# EAGLE design RGBoard (EAGLE 6.0)
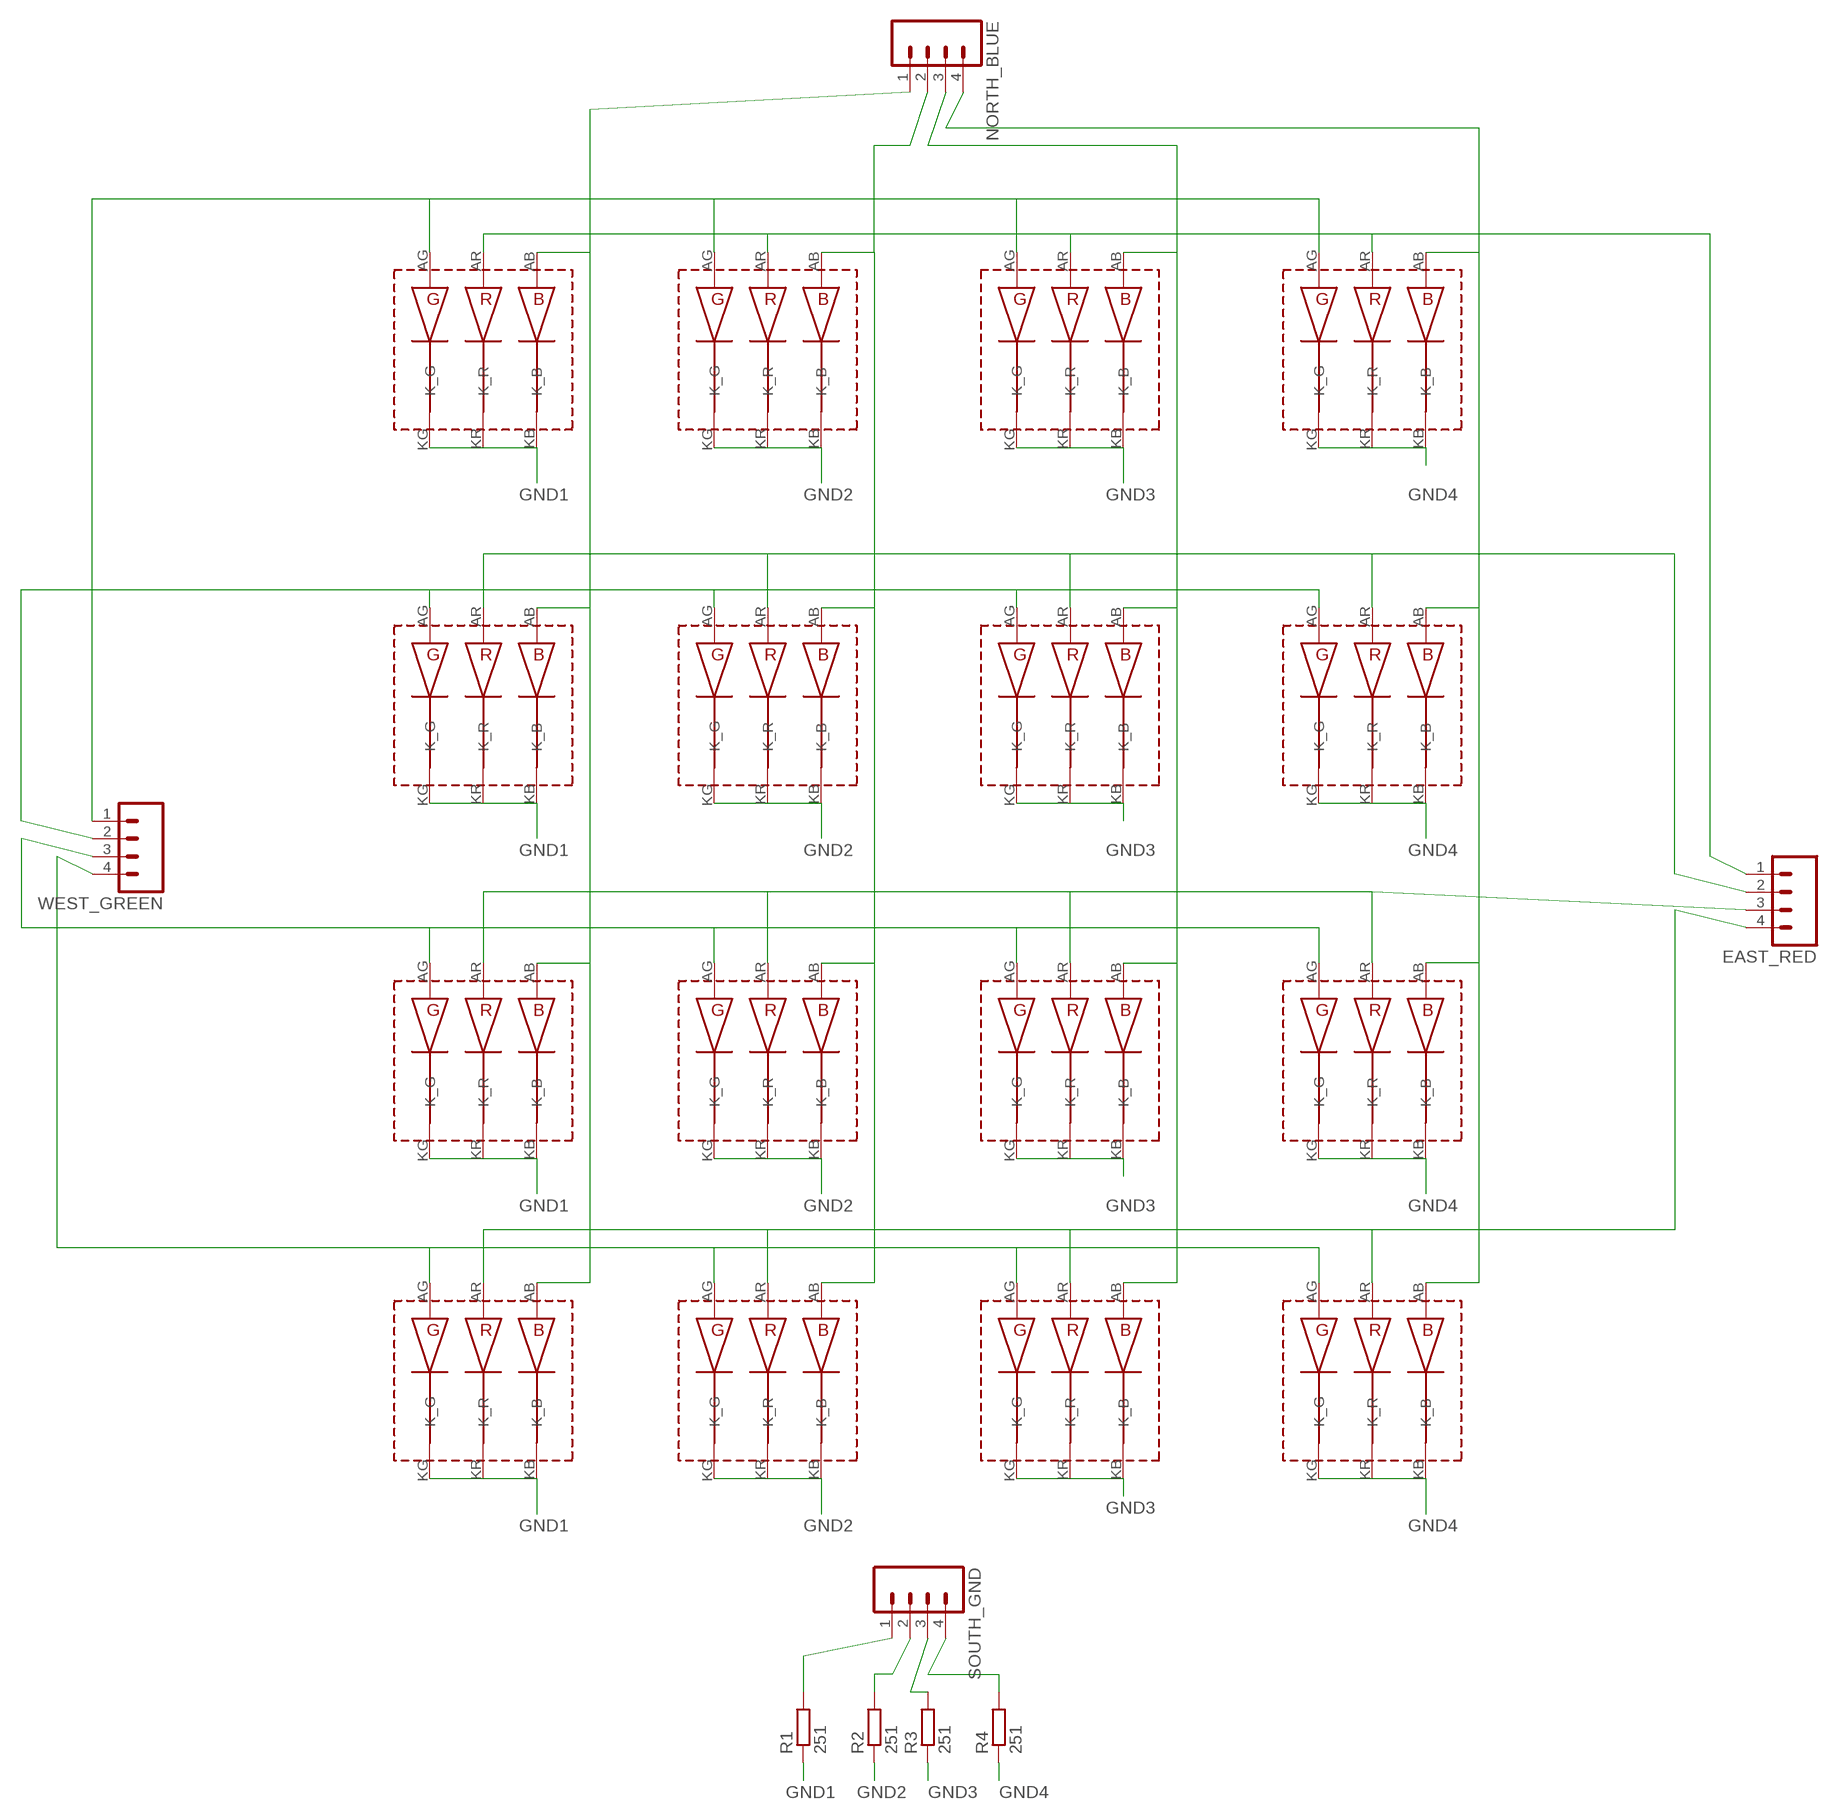
[diagram p0: schematic, sheet 1]

## Parts
A1  RGB-SMT-SQUARE  [SMT-SQUARE6]
A2  RGB-SMT-SQUARE  [SMT-SQUARE6]
A3  RGB-SMT-SQUARE  [SMT-SQUARE6]
A4  RGB-SMT-SQUARE  [SMT-SQUARE6]
B1  RGB-SMT-SQUARE  [SMT-SQUARE6]
B2  RGB-SMT-SQUARE  [SMT-SQUARE6]
B3  RGB-SMT-SQUARE  [SMT-SQUARE6]
B4  RGB-SMT-SQUARE  [SMT-SQUARE6]
C1  RGB-SMT-SQUARE  [SMT-SQUARE6]
C2  RGB-SMT-SQUARE  [SMT-SQUARE6]
C3  RGB-SMT-SQUARE  [SMT-SQUARE6]
C4  RGB-SMT-SQUARE  [SMT-SQUARE6]
D1  RGB-SMT-SQUARE  [SMT-SQUARE6]
D2  RGB-SMT-SQUARE  [SMT-SQUARE6]
D3  RGB-SMT-SQUARE  [SMT-SQUARE6]
D4  RGB-SMT-SQUARE  [SMT-SQUARE6]
EAST_RED  M04PTH  [1X04]
NORTH_BLUE  M04PTH  [1X04]
R1  251  R-EU_0204/7  [0204/7]
R2  251  R-EU_0204/7  [0204/7]
R3  251  R-EU_0204/7  [0204/7]
R4  251  R-EU_0204/7  [0204/7]
SOUTH_GND  M04PTH  [1X04]
WEST_GREEN  M04PTH  [1X04]

## Nets
GND1: A1.KB(K_B) A1.KG(K_G) A1.KR(K_R) B1.KB(K_B) B1.KG(K_G) B1.KR(K_R) C1.KB(K_B) C1.KG(K_G) C1.KR(K_R) D1.KB(K_B) D1.KG(K_G) D1.KR(K_R) R1.1
GND2: A2.KB(K_B) A2.KG(K_G) A2.KR(K_R) B2.KB(K_B) B2.KG(K_G) B2.KR(K_R) C2.KB(K_B) C2.KG(K_G) C2.KR(K_R) D2.KB(K_B) D2.KG(K_G) D2.KR(K_R) R2.1
GND3: A3.KB(K_B) A3.KG(K_G) A3.KR(K_R) B3.KB(K_B) B3.KG(K_G) B3.KR(K_R) C3.KB(K_B) C3.KG(K_G) C3.KR(K_R) D3.KB(K_B) D3.KG(K_G) D3.KR(K_R) R3.1
GND4: A4.KB(K_B) A4.KG(K_G) A4.KR(K_R) B4.KB(K_B) B4.KG(K_G) B4.KR(K_R) C4.KB(K_B) C4.KG(K_G) C4.KR(K_R) D4.KB(K_B) D4.KG(K_G) D4.KR(K_R) R4.1
N$1: R1.2 SOUTH_GND.1
N$2: R2.2 SOUTH_GND.2
N$3: R3.2 SOUTH_GND.3
N$4: R4.2 SOUTH_GND.4
N$5: A1.AR(ANODE_R) A2.AR(ANODE_R) A3.AR(ANODE_R) A4.AR(ANODE_R) EAST_RED.1
N$6: B1.AR(ANODE_R) B2.AR(ANODE_R) B3.AR(ANODE_R) B4.AR(ANODE_R) EAST_RED.2
N$7: C1.AR(ANODE_R) C2.AR(ANODE_R) C3.AR(ANODE_R) C4.AR(ANODE_R) EAST_RED.3
N$8: D1.AR(ANODE_R) D2.AR(ANODE_R) D3.AR(ANODE_R) D4.AR(ANODE_R) EAST_RED.4
N$9: A1.AB(ANODE_B) B1.AB(ANODE_B) C1.AB(ANODE_B) D1.AB(ANODE_B) NORTH_BLUE.1
N$10: A2.AB(ANODE_B) B2.AB(ANODE_B) C2.AB(ANODE_B) D2.AB(ANODE_B) NORTH_BLUE.2
N$11: A3.AB(ANODE_B) B3.AB(ANODE_B) C3.AB(ANODE_B) D3.AB(ANODE_B) NORTH_BLUE.3
N$12: A4.AB(ANODE_B) B4.AB(ANODE_B) C4.AB(ANODE_B) D4.AB(ANODE_B) NORTH_BLUE.4
N$13: A1.AG(ANODE_G) A2.AG(ANODE_G) A3.AG(ANODE_G) A4.AG(ANODE_G) WEST_GREEN.1
N$14: B1.AG(ANODE_G) B2.AG(ANODE_G) B3.AG(ANODE_G) B4.AG(ANODE_G) WEST_GREEN.2
N$15: C1.AG(ANODE_G) C2.AG(ANODE_G) C3.AG(ANODE_G) C4.AG(ANODE_G) WEST_GREEN.3
N$16: D1.AG(ANODE_G) D2.AG(ANODE_G) D3.AG(ANODE_G) D4.AG(ANODE_G) WEST_GREEN.4

## Library data of the parts
A1-A4 B1-B4 C1-C4 D1-D4 = kalshagar:RGB-SMT-SQUARE: A simple SMD RGB led square in about 6x6.6mm. Different models possible, be careful of the pinout (can be interverted so annotate your schema) Sold here http://akizukidenshi.com/catalog/g/gI-02225/
EAST_RED NORTH_BLUE SOUTH_GND WEST_GREEN = SparkFun:M04: Header 4 Standard 4-pin 0.1" header. Use with straight break away headers (SKU : PRT-00116), right angle break away headers (PRT-00553), swiss pins (PRT-00743), machine pins (PRT-00117), and female headers (PRT-00115). Molex polarized connector foot print use with SKU : PRT-08231 with associated crimp pins and housings. 1MM SMD Version SKU: PRT-10208
R1-R4 = resistor:R-EU_: RESISTOR, European symbol

## Board
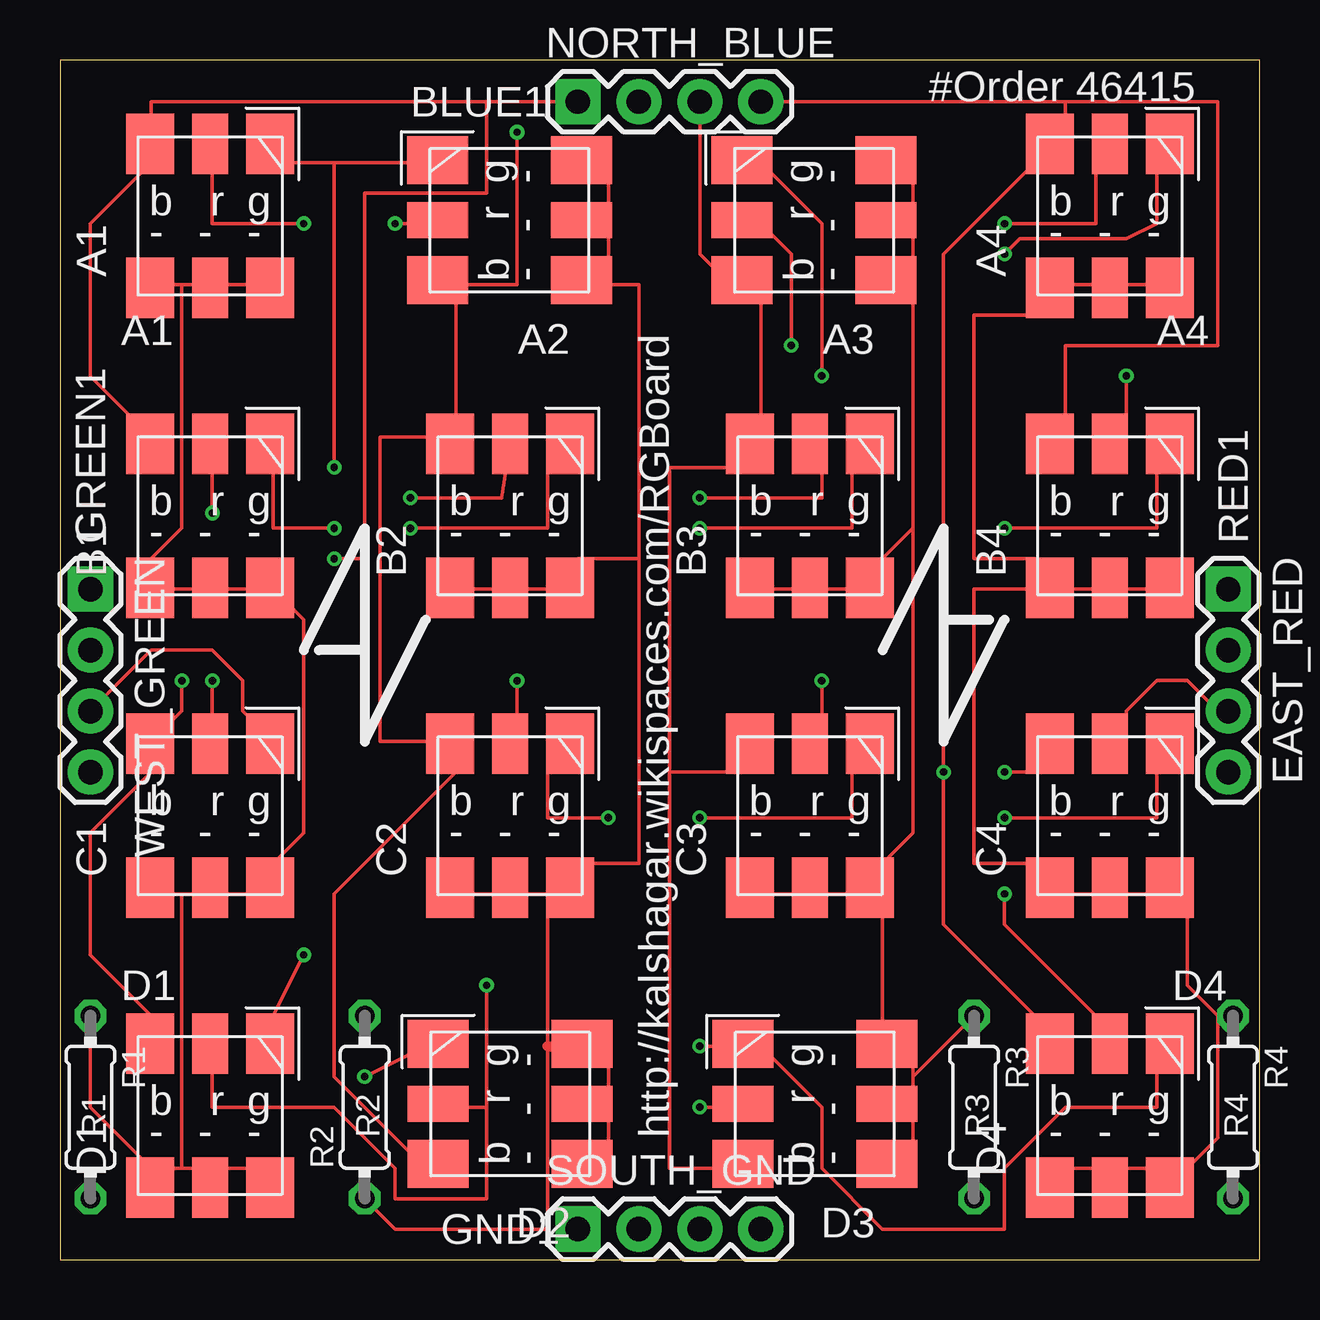
[diagram p1: board, top side]
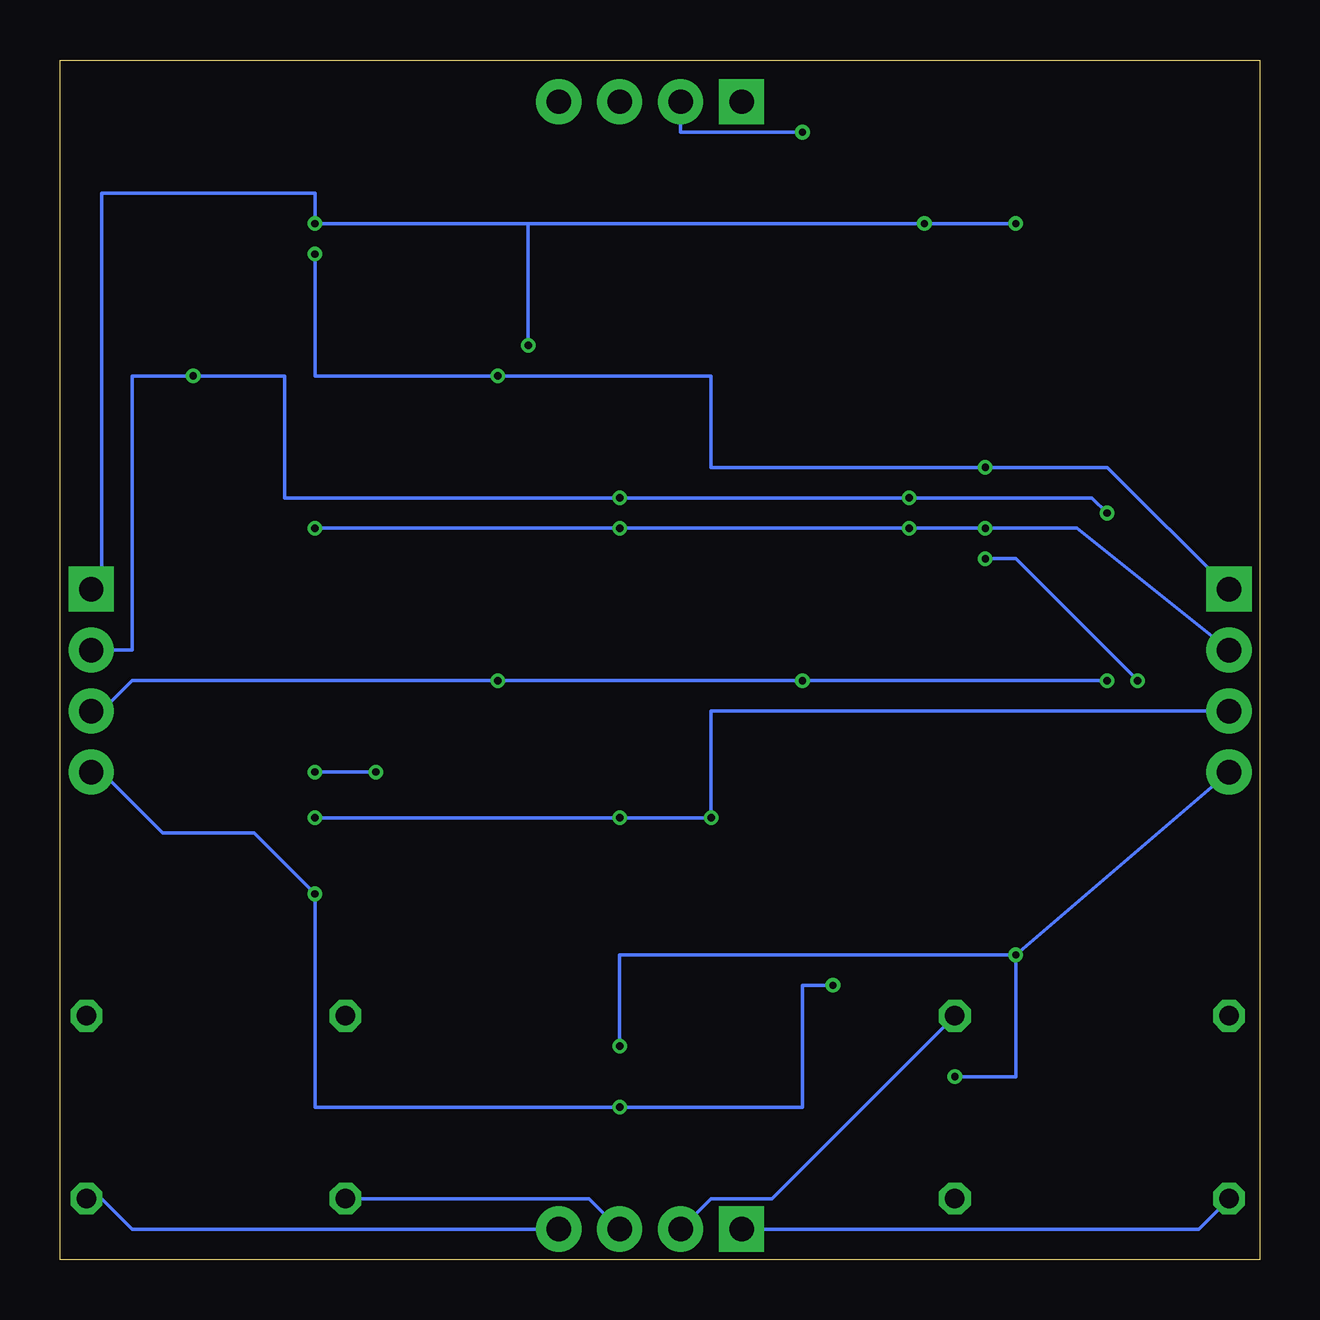
[diagram p2: board, bottom side, seen from below]

Size 50 x 50 mm. Coordinates in mm from the lower left corner, seen from the top.
Outline: 0,0 50,0 50,50 0,50 0,0
Copper layers (1*16): Top 0.035mm / dielectric 1.5mm / Bottom 0.035mm
Design rules: minimum track width 6mil, minimum drill 12mil, track to track 6mil, track to pad 6mil, pad to pad 6mil, via to via 6mil, smd to smd 0mil, copper to edge 10mil, drill to drill 10mil, minimum pad ring 10mil, minimum via ring 6mil, stop-mask expansion 2mil, vias tented up to drill 100mil, thermal gap 10mil

### Footprints (pad centres in the part's own frame; a part is rotated, then mirrored left to right if it is on the bottom)
SMT-SQUARE6 = smd 2 x 2.54: AB 0.5,3; AG 5.5,3; KB 0.5,-3; KG 5.5,-3 | smd 1.5 x 2.54: AR 3,3; KR 3,-3
1X04 = drill 1.016 pad 1.88 square: 1 0,0 | drill 1.016 pad 1.88: 2 2.54,0; 3 5.08,0; 4 7.62,0
0204/7 = drill 0.813 octagon: 1 -3.81,0; 2 3.81,0

### Placement (x,y rotation side)
A1  3.25,43.5 0 top
A2  18.73,40.31 90 top
A3  31.43,40.31 90 top
A4  40.75,43.5 0 top
B1  3.25,31 0 top
B2  15.75,31 0 top
B3  28.25,31 0 top
B4  40.75,31 0 top
C1  3.25,18.5 0 top
C2  15.75,18.5 0 top
C3  28.25,18.5 0 top
C4  40.75,18.5 0 top
D1  3.25,6 0 top
D2  18.77,3.48 90 top
D3  31.46,3.48 90 top
D4  40.75,6 0 top
EAST_RED  48.7,27.94 270 top
NORTH_BLUE  21.59,48.26 0 top
R1  1.27,6.35 270 top
R2  12.7,6.35 90 top
R3  38.1,6.35 270 top
R4  48.9,6.35 270 top
SOUTH_GND  21.59,1.27 0 top
WEST_GREEN  1.27,27.94 270 top

### Tracks (layer width: path | path; a pad name or v marks a point on that pad's centre or on a via)
GND1
  Top 0.152: 6.35,27.94 3.81,27.94 B1.KB 3.81,29.21 5.08,30.48 5.08,40.64 | 6.35,27.94 8.89,27.94 | 6.35,27.94 B1.KR | 6.35,40.64 5.08,40.64 | 5.08,40.64 3.81,40.64 A1.KB | 6.35,40.64 8.89,40.64 A1.KG | 6.35,40.64 A1.KR | 6.35,15.24 5.08,15.24 | 5.08,15.24 3.81,15.24 C1.KB | 6.35,15.24 8.89,15.24 C1.KG 8.89,16.51 10.16,17.78 10.16,26.67 8.89,27.94 | 6.35,15.24 C1.KR | 6.35,3.81 5.08,3.81 | 5.08,3.81 3.81,3.81 | 6.35,3.81 8.89,3.81 D1.KG | 6.35,3.81 D1.KR | R1.1 1.27,6.35 3.81,3.81 | 3.81,3.81 D1.KB | 5.08,3.81 5.08,15.24 | 8.89,27.94 B1.KG
GND2
  Top 0.152: 22.86,6.35 22.86,3.81 D2.KB | 22.86,6.35 22.86,8.89 D2.KG 21.59,8.89 | 22.86,6.35 D2.KR | 19.05,15.24 16.51,15.24 C2.KB | 19.05,15.24 20.32,15.24 | 19.05,15.24 C2.KR | R2.1 13.97,1.27 20.32,1.27 20.32,8.89 20.32,15.24 | 20.32,15.24 C2.KG 21.59,16.51 24.13,16.51 24.13,29.21 | 19.05,27.94 16.51,27.94 B2.KB | 19.05,27.94 20.32,27.94 B2.KG 21.59,29.21 24.13,29.21 | 19.05,27.94 B2.KR | 22.86,43.18 22.86,40.64 | 22.86,43.18 22.86,45.72 A2.KG | 22.86,43.18 A2.KR | 22.86,40.64 24.13,40.64 24.13,29.21 | 22.86,40.64 A2.KB
  Top 0.406: 20.32,8.89 21.59,8.89
GND3
  Top 0.152: 31.75,15.24 29.21,15.24 C3.KB | 31.75,15.24 33.02,15.24 C3.KG | 31.75,15.24 C3.KR | 35.56,6.35 35.56,3.81 D3.KB | 35.56,6.35 35.56,7.62 | 35.56,7.62 35.56,8.89 D3.KG 34.29,8.89 34.29,15.24 C3.KG | 35.56,6.35 D3.KR | 35.56,7.62 R3.1 | 31.75,27.94 29.21,27.94 B3.KB | 31.75,27.94 33.02,27.94 B3.KG 34.29,29.21 35.56,30.48 | 31.75,27.94 B3.KR | 35.56,43.18 35.56,40.64 | 35.56,43.18 35.56,45.72 A3.KG | 35.56,43.18 A3.KR | 35.56,40.64 35.56,30.48 | 35.56,40.64 A3.KB | 35.56,30.48 35.56,17.78 34.29,16.51 C3.KG
GND4
  Top 0.152: B4.KB 41.91,27.94 43.18,27.94 B4.KR 44.45,27.94 45.72,27.94 B4.KG | A4.KG 45.72,40.64 44.45,40.64 A4.KR 43.18,40.64 41.91,40.64 A4.KB 40.64,39.37 38.1,39.37 38.1,29.21 40.64,29.21 B4.KB | D4.KB 41.91,3.81 43.18,3.81 D4.KR 44.45,3.81 45.72,3.81 D4.KG 46.99,3.81 48.26,5.08 48.26,10.16 | 48.26,10.16 46.99,11.43 46.99,15.24 C4.KG 45.72,15.24 44.45,15.24 C4.KR 43.18,15.24 41.91,15.24 C4.KB 40.64,16.51 38.1,16.51 38.1,27.94 40.64,27.94 B4.KB | 48.26,10.16 R4.1
N$1
  Bottom 0.152: R1.2 2.54,1.27 SOUTH_GND.1
N$2
  Bottom 0.152: R2.2 20.32,2.54 22.86,2.54 SOUTH_GND.2
N$3
  Bottom 0.152: R3.2 27.94,2.54 SOUTH_GND.3
N$4
  Bottom 0.152: SOUTH_GND.4 46.99,1.27 48.26,2.54 R4.2
N$5  (via drill 0.3)
  Top 0.152: v13.97,43.18 15.24,43.18 A2.AR | v10.16,43.18 6.35,43.18 6.35,45.72 A1.AR | v30.48,38.1 30.48,41.91 29.21,43.18 A3.AR | v39.37,43.18 43.18,43.18 43.18,45.72 A4.AR
  Bottom 0.152: v10.16,43.18 v13.97,43.18 30.48,43.18 | v30.48,38.1 30.48,43.18 | 30.48,43.18 v39.37,43.18 39.37,44.45 48.26,44.45 48.26,27.94 EAST_RED.1
N$6  (via drill 0.3)
  Top 0.152: v6.35,31.11 6.35,33.02 B1.AR | v14.61,31.75 18.41,31.75 B2.AR | v26.67,31.75 31.75,31.75 31.75,33.02 B3.AR | v44.45,36.83 44.45,34.29 B4.AR
  Bottom 0.152: v6.35,31.11 6.99,31.75 v14.61,31.75 v26.67,31.75 40.64,31.75 40.64,36.83 v44.45,36.83 46.99,36.83 46.99,25.4 EAST_RED.2
N$7  (via drill 0.3)
  Top 0.152: v6.35,24.13 6.35,21.59 C1.AR | v19.05,24.13 19.05,21.59 C2.AR | v31.75,24.13 31.75,21.59 C3.AR | C4.AR 44.45,21.59 44.45,22.86 45.72,24.13 46.99,24.13 48.26,22.86 EAST_RED.3
  Bottom 0.152: v6.35,24.13 v19.05,24.13 v31.75,24.13 46.99,24.13 48.26,22.86 EAST_RED.3
N$8  (via drill 0.3)
  Top 0.152: 17.78,6.35 16.51,6.35 D2.AR | 17.78,6.35 17.78,2.54 13.97,2.54 13.97,3.81 11.43,6.35 6.35,6.35 6.35,8.89 D1.AR | v26.67,6.35 29.21,6.35 D3.AR | v39.37,15.24 39.37,13.97 43.18,10.16 D4.AR | v17.78,11.43 17.78,6.35
  Bottom 0.152: EAST_RED.4 48.26,20.32 45.72,17.78 41.91,17.78 v39.37,15.24 39.37,6.35 v26.67,6.35 19.05,6.35 19.05,11.43 v17.78,11.43
N$9  (via drill 0.3)
  Top 0.152: D1.AB 3.81,10.16 1.27,12.7 1.27,17.78 3.81,20.32 C1.AB 3.81,21.59 5.08,22.86 v5.08,24.13 | B1.AB 3.81,34.29 1.27,36.83 1.27,43.18 3.81,45.72 A1.AB 3.81,46.99 3.81,48.26 17.78,48.26 | 17.78,48.26 NORTH_BLUE.1 | v11.43,29.21 12.7,29.21 12.7,44.45 17.78,44.45 17.78,48.26
  Bottom 0.152: v5.08,24.13 10.16,29.21 v11.43,29.21
N$10  (via drill 0.3)
  Top 0.152: D2.AB 15.24,3.81 11.43,7.62 11.43,15.24 16.51,20.32 C2.AB 16.51,21.59 13.34,21.59 13.34,34.29 15.24,34.29 B2.AB 16.51,34.29 16.51,40.64 | v19.05,46.99 19.05,40.64 16.51,40.64 | 16.51,40.64 A2.AB
  Bottom 0.152: NORTH_BLUE.2 24.13,46.99 v19.05,46.99
N$11
  Top 0.152: NORTH_BLUE.3 26.67,41.91 27.94,40.64 A3.AB 29.21,40.64 29.21,34.29 B3.AB 27.94,33.02 25.4,33.02 25.4,20.32 | 25.4,20.32 25.4,3.81 27.94,3.81 D3.AB | 25.4,20.32 27.94,20.32 C3.AB
N$12  (via drill 0.3)
  Top 0.152: D4.AB 40.64,10.16 36.83,13.97 v36.83,20.32 36.83,41.91 40.64,45.72 A4.AB 41.91,46.99 41.91,48.26 | v39.37,20.32 40.64,20.32 C4.AB | 41.91,48.26 48.26,48.26 48.26,38.1 41.91,38.1 41.91,34.29 B4.AB | 41.91,48.26 NORTH_BLUE.4
  Bottom 0.152: v36.83,20.32 v39.37,20.32
N$13  (via drill 0.3)
  Top 0.152: 11.43,45.72 8.89,45.72 A1.AG | 11.43,45.72 15.24,45.72 A2.AG | v31.75,36.83 31.75,43.18 29.21,45.72 A3.AG | v39.37,41.91 40.01,42.55 44.45,42.55 45.72,43.18 45.72,45.72 A4.AG | v11.43,33.02 11.43,45.72
  Bottom 0.152: WEST_GREEN.1 6.35,33.02 v11.43,33.02 22.86,33.02 22.86,36.83 v31.75,36.83 39.37,36.83 v39.37,41.91
N$14  (via drill 0.3)
  Top 0.152: v11.43,30.48 8.89,30.48 8.89,33.02 B1.AG | v14.61,30.48 20.32,30.48 20.32,33.02 B2.AG | v26.67,30.48 33.02,30.48 33.02,33.02 B3.AG | v39.37,30.48 45.72,30.48 45.72,33.02 B4.AG
  Bottom 0.152: WEST_GREEN.2 7.62,30.48 v11.43,30.48 v14.61,30.48 v26.67,30.48 v39.37,30.48
N$15  (via drill 0.3)
  Top 0.152: WEST_GREEN.3 3.81,25.4 6.35,25.4 7.62,24.13 7.62,22.86 8.89,21.59 C1.AG | v22.86,18.41 20.32,18.41 20.32,20.32 C2.AG | v26.67,18.41 33.02,18.41 33.02,20.32 C3.AG | v39.37,18.41 45.72,18.41 45.72,20.32 C4.AG
  Bottom 0.152: WEST_GREEN.3 22.86,22.86 v22.86,18.41 v26.67,18.41 v39.37,18.41
N$16  (via drill 0.3)
  Top 0.152: D4.AG 45.72,8.89 45.72,6.35 41.91,6.35 39.37,3.81 39.37,1.27 34.29,1.27 31.75,3.81 31.75,6.35 29.21,8.89 D3.AG 27.94,8.89 v26.67,8.89 | v12.7,7.62 15.24,8.89 D2.AG | v10.16,12.7 8.89,10.16 D1.AG
  Bottom 0.152: WEST_GREEN.4 v10.16,12.7 | v10.16,12.7 10.16,7.62 v12.7,7.62 | v26.67,8.89 26.67,12.7 v10.16,12.7

### Text on the board
_tNames: BLUE1 | #Order 46415 | A1 | A4 | GREEN1 | RED1 | D1 | D4 | R1 | R2 | http://kalshagar.wikispaces.com/RGBoard | R3 | R4 | GND1